# Altium schematic sheet STC16.SchDoc
size A2
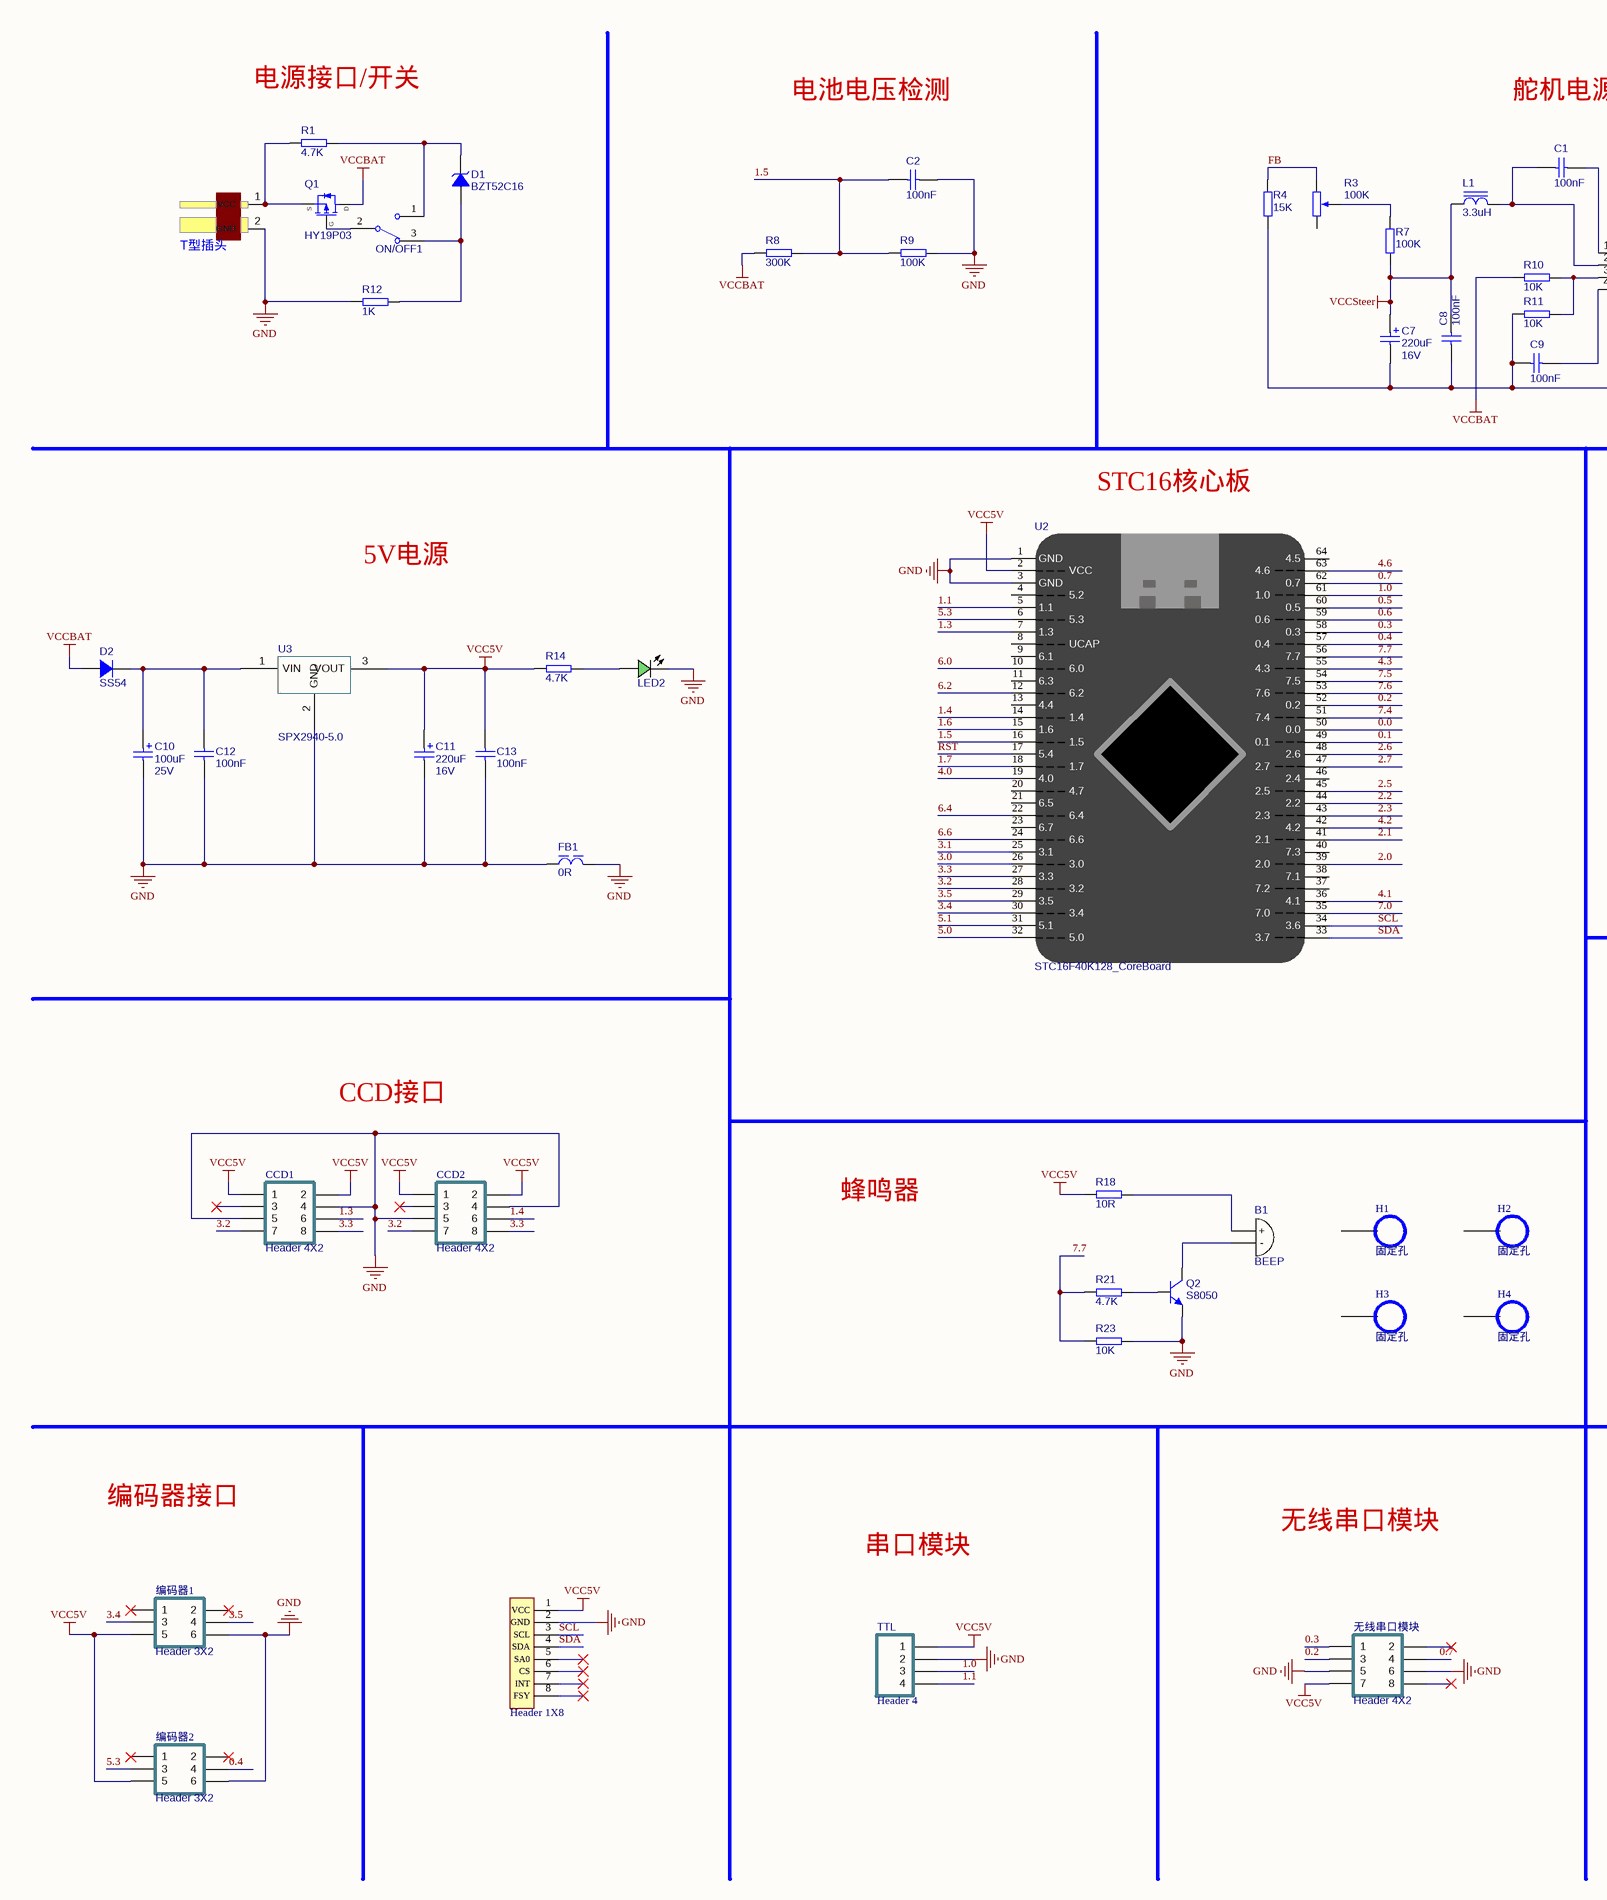
[diagram p0: STC16.SchDoc, left]
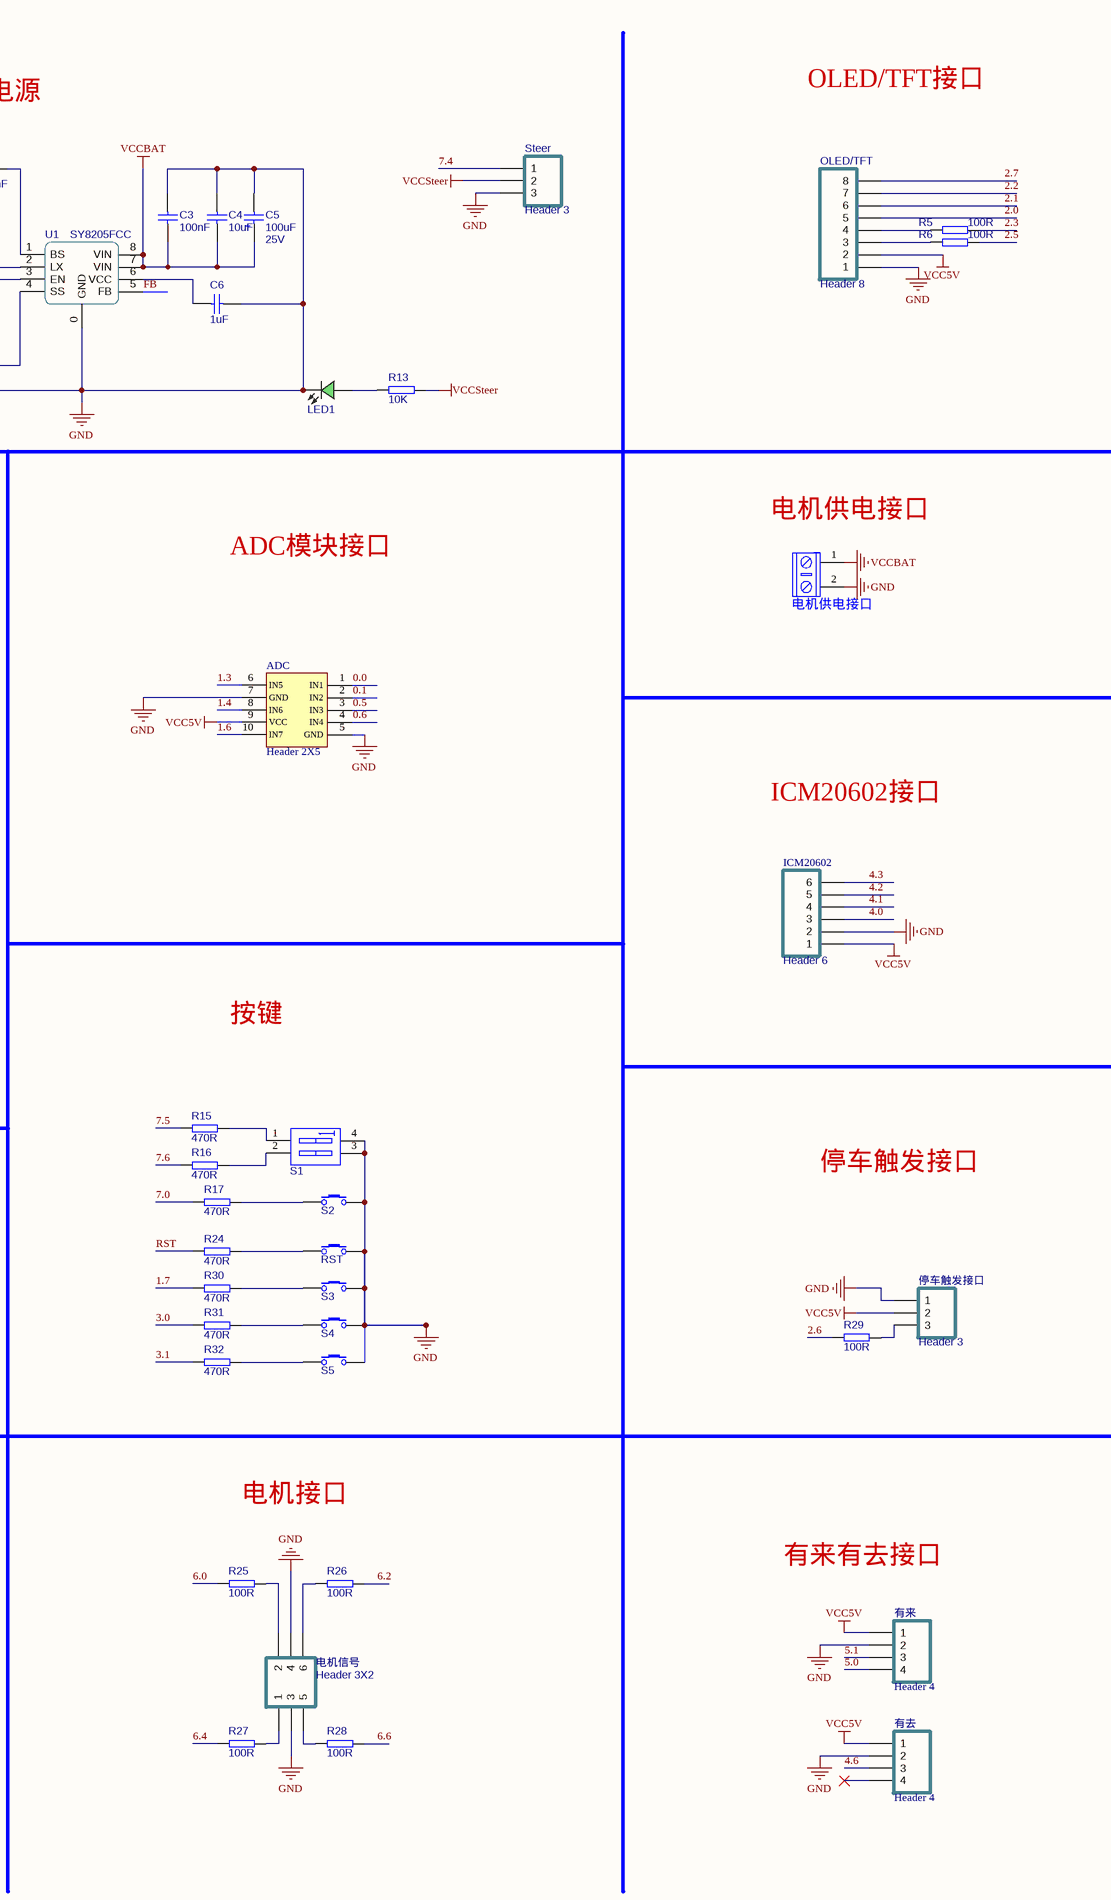
[diagram p1: STC16.SchDoc, right]

## Parts
ADC  Header 2X5  [HDR2X5]
B1  BEEP  [BEEP 9x5.5mm]
C1  value 100nF  [0603_C]  (hidden comment: 100nF ±10% 50V)
C2  value 100nF  [0603_C]  (hidden comment: 100nF ±10% 50V)
C3  value 100nF  [0603_C]  (hidden comment: 100nF ±10% 50V)
C4  value 10uF  [0603_C]  (hidden comment: 10uF ±10% 50V)
C5  value 100uF  Voltage: 25V  [CAPS6.3]  (hidden comment: 100uF 25V)
C6  value 1uF  [0603_C]  (hidden comment: 1uF ±10% 50V)
C7  value 220uF  Voltage: 16V  [CAPS6.3]  (hidden comment: 220uF 16V)
C8  value 100nF  [0603_C]  (hidden comment: 100nF ±10% 50V)
C9  value 100nF  [0603_C]  (hidden comment: 100nF ±10% 50V)
C10  value 100uF  Voltage: 25V  [CAPS6.3]  (hidden comment: 100uF 25V)
C11  value 220uF  Voltage: 16V  [CAPS6.3]  (hidden comment: 220uF 16V)
C12  value 100nF  [0603_C]  (hidden comment: 100nF ±10% 50V)
C13  value 100nF  [0603_C]  (hidden comment: 100nF ±10% 50V)
CCD1  Header 4X2  [Female-Header-2.54-SMD-8]
CCD2  Header 4X2  [Female-Header-2.54-SMD-8]
D1  BZT52C16  [SOD-123-L]
D2  SS54  [SMA[DO-214AC]]
DCIN1  T型插头  [Wired T-Header ThroughHole]
DCOUT1  电机供电接口  [KF/WJ/DG 301-2p-5.0mm]
FB1  0R  [0603_R]
H1  固定孔  [铜柱孔3]
H2  固定孔  [铜柱孔3]
H3  固定孔  [铜柱孔3]
H4  固定孔  [铜柱孔3]
ICM20602  Header 6  [HDR1X6]
L1  3.3uH  [0630 TPC 7*7*3]
LED1  GREEN  [LEDC1608(0603)]  (value not drawn)
LED2  GREEN  [LEDC1608(0603)]  (value not drawn)
MPU  Header 1X8  [HDR1X8]
OLED/TFT  Header 8  [HDR1X8]
ON/OFF1  SW-SPDT  [SS12D10]  (value not drawn)
Q1  HY19P03  [TO-252AA]
Q2  S8050  [SOT-23]
R1  value 4.7K  [0603_R]  (hidden comment: 4.7K ±1%)
R3  100K  [RESPOT3296]
R4  value 15K  [0603_R]  (hidden comment: 15K ±1%)
R5  value 100R  [0603_R]  (hidden comment: 100R ±1%)
R6  value 100R  [0603_R]  (hidden comment: 100R ±1%)
R7  value 100K  [0603_R]  (hidden comment: 100K ±1%)
R8  value 300K  [0603_R]  (hidden comment: 300K ±1%)
R9  value 100K  [0603_R]  (hidden comment: 100K ±1%)
R10  value 10K  [0603_R]  (hidden comment: 10K ±1%)
R11  value 10K  [0603_R]  (hidden comment: 10K ±1%)
R12  value 1K  [0603_R]  (hidden comment: 1K ±1%)
R13  value 10K  [0603_R]  (hidden comment: 10K ±1%)
R14  value 4.7K  [0603_R]  (hidden comment: 4.7K ±1%)
R15  value 470R  [0603_R]  (hidden comment: 470R ±1%)
R16  value 470R  [0603_R]  (hidden comment: 470R ±1%)
R17  value 470R  [0603_R]  (hidden comment: 470R ±1%)
R18  value 10R  [0603_R]  (hidden comment: 10R ±1%)
R21  value 4.7K  [0603_R]  (hidden comment: 4.7K ±1%)
R23  value 10K  [0603_R]  (hidden comment: 10K ±1%)
R24  value 470R  [0603_R]  (hidden comment: 470R ±1%)
R25  value 100R  [0603_R]  (hidden comment: 100R ±1%)
R26  value 100R  [0603_R]  (hidden comment: 100R ±1%)
R27  value 100R  [0603_R]  (hidden comment: 100R ±1%)
R28  value 100R  [0603_R]  (hidden comment: 100R ±1%)
R29  value 100R  [0603_R]  (hidden comment: 100R ±1%)
R30  value 470R  [0603_R]  (hidden comment: 470R ±1%)
R31  value 470R  [0603_R]  (hidden comment: 470R ±1%)
R32  value 470R  [0603_R]  (hidden comment: 470R ±1%)
RST  Button  [PTS810-3*4-CurvePin]  (value not drawn)
S1  SW DIP-2  [DIP4]  (value not drawn)
S2  Button  [PTS810-3*4-CurvePin]  (value not drawn)
S3  Button  [PTS810-3*4-CurvePin]  (value not drawn)
S4  Button  [PTS810-3*4-CurvePin]  (value not drawn)
S5  Button  [PTS810-3*4-CurvePin]  (value not drawn)
Steer  Header 3  [HDR1X3]
TTL  Header 4  [HDR1X4]
U1  SY8205FCC  [SOP-8E]
U2  STC16F40K128_CoreBoard  [STC16F40K128_CoreBoard]
U3  SPX2940-5.0  [TO-263-3]
停车触发接口  Header 3  [HDR1X3]
无线串口模块  Header 4X2  [Female-Header-2.54-SMD-8]
有去  Header 4  [HDR1X4]
有来  Header 4  [HDR1X4]
电机信号  Header 3X2  [HDR2X3-M-SMT]
编码器1  Header 3X2  [HDR2X3-M-SMT]
编码器2  Header 3X2  [HDR2X3-M-SMT]

## Nets
GND: ADC.5(GND) ADC.7(GND) C2.2 C3.1 C4.2 C5.2 C6.2 C7.2 C8.1 C9.1 C10.2 C11.2 C12.1 C13.1 CCD1.4 CCD1.5 CCD2.4 CCD2.5 DCIN1.2(GND) DCOUT1.2 FB1.1 FB1.2 ICM20602.2 LED1.C LED2.C MPU.2(GND) OLED/TFT.1 Q2.2(E) R4.1 R9.2 R11.2 R12.1 R23.2 RST.1 S1.3(B2) S1.4(B1) S2.1 S3.1 S4.1 S5.1 Steer.3 TTL.2 U1.0(GND) U2.1(GND) U2.3(GND) U3.2(GND) 停车触发接口.1 无线串口模块.5 无线串口模块.6 有去.2 有来.2 电机信号.3 电机信号.4 编码器1.6 编码器2.6
VCC5V: ADC.9(VCC) C11.1 C13.2 CCD1.1 CCD1.2 CCD2.1 CCD2.2 ICM20602.1 MPU.1(VCC) OLED/TFT.2 R14.1 R18.1 TTL.1 U2.2(VCC) U3.3(VOUT) 停车触发接口.2 无线串口模块.7 有去.1 有来.1 编码器1.5 编码器2.5
VCCBAT: C3.2 C4.1 C5.1 D2.A DCOUT1.1 Q1.1(D) R8.1 R10.2 U1.7(VIN) U1.8(VIN)
VCCSteer: C7.1 C8.2 L1.1 R7.1 R13.1 Steer.2
0.0: ADC.1(IN1) U2.50(0.0)
0.1: ADC.2(IN2) U2.49(0.1)
0.2: U2.52(0.2) 无线串口模块.3
0.3: U2.58(0.3) 无线串口模块.1
0.4: U2.57(0.4) 编码器2.4
0.5: ADC.3(IN3) U2.60(0.5)
0.6: ADC.4(IN4) U2.59(0.6)
0.7: U2.62(0.7) 无线串口模块.4
1.0: TTL.3 U2.61(1.0)
1.1: TTL.4 U2.5(1.1)
1.3: ADC.6(IN5) CCD1.6 U2.7(1.3)
1.4: ADC.8(IN6) CCD2.6 U2.14(1.4)
1.5: C2.1 R8.2 R9.1 U2.16(1.5)
1.6: ADC.10(IN7) U2.15(1.6)
1.7: R30.1 U2.18(1.7)
2.0: OLED/TFT.5 U2.39(2.0)
2.1: OLED/TFT.6 U2.41(2.1)
2.2: OLED/TFT.7 U2.44(2.2)
2.3: R5.2 U2.43(2.3)
2.5: R6.2 U2.45(2.5)
2.6: R29.1 U2.48(2.6)
2.7: OLED/TFT.8 U2.47(2.7)
3.0: R31.1 U2.26(3.0)
3.1: R32.1 U2.25(3.1)
3.2: CCD1.7 CCD2.7 U2.28(3.2)
3.3: CCD1.8 CCD2.8 U2.27(3.3)
3.4: U2.30(3.4) 编码器1.3
3.5: U2.29(3.5) 编码器1.4
4.0: ICM20602.3 U2.19(4.0)
4.1: ICM20602.4 U2.36(4.1)
4.2: ICM20602.5 U2.42(4.2)
4.3: ICM20602.6 U2.55(4.3)
4.6: U2.63(4.6) 有去.3
5.0: U2.32(5.0) 有来.4
5.1: U2.31(5.1) 有来.3
5.3: U2.6(5.3) 编码器2.3
6.0: R25.2 U2.10(6.0)
6.2: R26.1 U2.12(6.2)
6.4: R27.2 U2.22(6.4)
6.6: R28.1 U2.24(6.6)
7.0: R17.1 U2.35(7.0)
7.4: Steer.1 U2.51(7.4)
7.5: R15.1 U2.54(7.5)
7.6: R16.1 U2.53(7.6)
7.7: R21.1 R23.1 U2.56(7.7)
FB: R3.2(BOT) R4.2 U1.5(FB)
RST: R24.1 U2.17(5.4)
SCL: MPU.3(SCL) U2.34(3.6)
SDA: MPU.4(SDA) U2.33(3.7)
NetB1_1: B1.1(+) R18.2
NetB1_2: B1.2(-) Q2.3(C)
NetC1_1: C1.1 U1.1(BS)
NetC1_2: C1.2 L1.2 U1.2(LX)
NetC6_1: C6.1 U1.6(VCC)
NetC9_2: C9.2 U1.4(SS)
NetC10_1: C10.1 C12.2 D2.K U3.1(VIN)
NetD1_A: D1.A ON/OFF1.3 R12.2
NetD1_K: D1.K ON/OFF1.1 R1.2
NetDCIN1_1: DCIN1.1(VCC) Q1.3(S) R1.1
NetLED1_A: LED1.A R13.2
NetLED2_A: LED2.A R14.2
NetOLED/TFT_3: OLED/TFT.3 R6.1
NetOLED/TFT_4: OLED/TFT.4 R5.1
NetON/OFF1_2: ON/OFF1.2 Q1.2(G)
NetQ2_1: Q2.1(B) R21.2
NetR3_ADJ: R3.ADJ R7.2
NetR10_1: R10.1 R11.1 U1.3(EN)
NetR15_2: R15.2 S1.1(A1)
NetR16_2: R16.2 S1.2(A2)
NetR17_2: R17.2 S2.2
NetR24_2: R24.2 RST.2
NetR25_1: R25.1 电机信号.2
NetR26_2: R26.2 电机信号.6
NetR27_1: R27.1 电机信号.1
NetR28_2: R28.2 电机信号.5
NetR29_2: R29.2 停车触发接口.3
NetR30_2: R30.2 S3.2
NetR31_2: R31.2 S4.2
NetR32_2: R32.2 S5.2

Not connected (* = marked no-connect by the designer): CCD1 3*; CCD2 3*; H1 11; H2 11; H3 11; H4 11; MPU 5(SA0)* 6(CS)* 7(INT)* 8(FSY)*; R3 1(TOP); U2 4(5.2) 8(UCAP) 9(6.1) 11(6.3) 13(4.4) 20(4.7) 21(6.5) 23(6.7) 37(7.2) 38(7.1) 40(7.3) 46(2.4) 64(4.5); 无线串口模块 2* 8*; 有去 4*; 编码器1 1* 2*; 编码器2 1* 2*

## Notes on the sheet
- 电源接口/开关
- 电池电压检测
- 舵机电源
- OLED/TFT接口
- STC16核心板
- (near DCOUT1) 电机供电接口
- 5V电源
- ADC模块接口
- ICM20602接口
- 按键
- CCD接口
- 蜂鸣器
- 停车触发接口
- 编码器接口
- 电机接口
- 串口模块
- 无线串口模块
- 有来有去接口

## Library data of the parts
B1 = BEEP: 蜂鸣器
C1-C3 C8 C12 C13 = Cap-Chip: 贴片电容100nF; Published: 8-Jun-2000; Revision: July-2002: Re-released for DXP Platform.; Publisher: Altium Limited; Price(RMB): 0.000; Voltage: 50V; Tolerance: ±10%
C4 C9 = Cap-Chip_2: 贴片电容10uF; Published: 8-Jun-2000; Revision: July-2002: Re-released for DXP Platform.; Publisher: Altium Limited; Price(RMB): 0.000; Voltage: 50V; Tolerance: ±10%
C5 C10 = Cap-Solid: Polarized Capacitor (Radial) 100uF，25V; Published: 8-Jun-2000; Revision: July-2002: Re-released for DXP Platform.; Publisher: Altium Limited; Price(RMB): 0.000
C6 = Cap-Chip_1: 贴片电容1uF; Published: 8-Jun-2000; Revision: July-2002: Re-released for DXP Platform.; Publisher: Altium Limited; Price(RMB): 0.000; Voltage: 50V; Tolerance: ±10%
C7 C11 = Cap-Solid_1: Polarized Capacitor (Radial)  220uF 16V; Published: 8-Jun-2000; Revision: July-2002: Re-released for DXP Platform.; Publisher: Altium Limited; Price(RMB): 0.000
CCD1 CCD2 无线串口模块 = Header 4X2: Header, 4-Pin, Dual row; LatestRevisionDate: 17-Jul-2002; LatestRevisionNote: Re-released for DXP Platform.; Publisher: Altium Limited; Price(RMB): 0.00
D1 = Diode TVS Uni-Dir: TRANSIENT VOLTAGE  SUPPRESSOR DIODE; Imax: 500mA; Published: 8-Jun-2000; Publisher: Altium Limited; Price(RMB): 0.000
D2 = Diode: 普通二极管 Diode; Imax: 500mA; Published: 8-Jun-2000; Revision: July-2002: Re-released for DXP Platform.; Publisher: Altium Limited; Price(RMB): 0.000
DCIN1 = T_Header
DCOUT1 = KF/WJ/DG 30x: 接线端子 2Pin
FB1 = Ind Chip 2: Chip Inductor, Ferrite-Core, Silkscreen Border; Imax: 50mA; DCR: .1m; Published: 8-Jun-2000; Revision: July-2002: Re-released for DXP Platform.; Publisher: Altium Limited; Price(RMB): 0.000; Value: 0R
ICM20602 = Header 6: Header, 6-Pin; LatestRevisionDate: 17-Jul-2002; LatestRevisionNote: Re-released for DXP Platform.; Publisher: Altium Limited; Price(RMB): 0.00
L1 = Ind Power: Power Inductor, Ferrite-Core; Imax: 50mA; DCR: .5m; Published: 8-Jun-2000; Revision: July-2002: Re-released for DXP Platform.; Publisher: Altium Limited; Price(RMB): 0.000; Value: 3.3uH
LED1 LED2 = LED Chip Green: Typical Chip LED; Published: 8-Jun-2000; Revision: July-2002: Re-released for DXP Platform.; Publisher: Altium Limited; Price(RMB): 0.00
OLED/TFT = Header 8: Header, 8-Pin; LatestRevisionDate: 17-Jul-2002; LatestRevisionNote: Re-released for DXP Platform.; Publisher: Altium Limited; Price(RMB): 0.00
ON/OFF1 = SW-SPDT: 单刀双掷开关 3脚船型、钮子、拨动开关 SPDT Subminiature Toggle Switch; Published: 24-Mar-1999; Publisher: Altium Limited; Price(RMB): 0.000
Q1 = HY19P03: HY19P03 P-Channel MOSFET
Q2 = NPN S8050: Discrete NPN Bipolar Transistor; Published: 8-Jun-2000; Revision: July-2002: Re-released for DXP Platform.; Publisher: Altium Limited; Price(RMB): 0.000; PartNumber: S8050
R1 R14 R21 = Res-Chip: 贴片电阻4.7K; Published: 8-Jun-2000; Revision: July-2002: Re-released for DXP Platform.; Publisher: Altium Limited; Price(RMB): 0.000; Tolerance: ±1%
R3 = Res Adj 3p: 可调电阻; Value: 100K
R4 = Res-Chip: 贴片电阻15K; Published: 8-Jun-2000; Revision: July-2002: Re-released for DXP Platform.; Publisher: Altium Limited; Price(RMB): 0.000; Tolerance: ±1%
R5 R6 R25-R29 = Res-Chip_5: 贴片电阻100R; Published: 8-Jun-2000; Revision: July-2002: Re-released for DXP Platform.; Publisher: Altium Limited; Price(RMB): 0.000; Tolerance: ±1%
R7 R10 R11 R13 = Res-Chip: 贴片电阻10K; Published: 8-Jun-2000; Revision: July-2002: Re-released for DXP Platform.; Publisher: Altium Limited; Price(RMB): 0.000; Tolerance: ±1%
R8 = Res-Chip_7: 贴片电阻; Published: 8-Jun-2000; Revision: July-2002: Re-released for DXP Platform.; Publisher: Altium Limited; Price(RMB): 0.000; Tolerance: ±1%
R9 = Res-Chip_1: 贴片电阻100K; Published: 8-Jun-2000; Revision: July-2002: Re-released for DXP Platform.; Publisher: Altium Limited; Price(RMB): 0.000; Tolerance: ±1%
R12 = Res-Chip_4: 贴片电阻1K; Published: 8-Jun-2000; Revision: July-2002: Re-released for DXP Platform.; Publisher: Altium Limited; Price(RMB): 0.000; Tolerance: ±1%
R15-R17 R24 R30-R32 = Res-Chip_8: 贴片电阻; Published: 8-Jun-2000; Revision: July-2002: Re-released for DXP Platform.; Publisher: Altium Limited; Price(RMB): 0.000; Tolerance: ±1%
R18 = Res-Chip_6: 贴片电阻; Published: 8-Jun-2000; Revision: July-2002: Re-released for DXP Platform.; Publisher: Altium Limited; Price(RMB): 0.000; Tolerance: ±1%
R23 = Res-Chip_3: 贴片电阻10K; Published: 8-Jun-2000; Revision: July-2002: Re-released for DXP Platform.; Publisher: Altium Limited; Price(RMB): 0.000; Tolerance: ±1%
RST S2-S5 = KEY: 按键; Published: 24-Mar-1999; Publisher: Altium Limited; Price(RMB): 0.000
S1 = Code SW-2: 2位拨码开关; Published: 24-Mar-1999; Revision: July-2002: Re-released for DXP Platform.; Publisher: Altium Limited; Price(RMB): 0.000
Steer 停车触发接口 = Header 3: Header, 3-Pin; LatestRevisionDate: 17-Jul-2002; LatestRevisionNote: Re-released for DXP Platform.; Publisher: Altium Limited; Price(RMB): 0.00
TTL 有去 有来 = Header 4: Header, 4-Pin; LatestRevisionDate: 17-Jul-2002; LatestRevisionNote: Re-released for DXP Platform.; Publisher: Altium Limited; Price(RMB): 0.00
U1 = SY8205FCC: 同步buck
U2 = STC16F40K128_CoreBoard: 逐飞科技 STC16F40K128核心板
U3 = LM2940-5.0: 5V LDO TO-263-3
电机信号 编码器1 编码器2 = Header 3X2: Header, 3-Pin, Dual row; LatestRevisionDate: 17-Jul-2002; LatestRevisionNote: Re-released for DXP Platform.; Publisher: Altium Limited; Price(RMB): 0.00